# Altium project silnik.PrjPcb
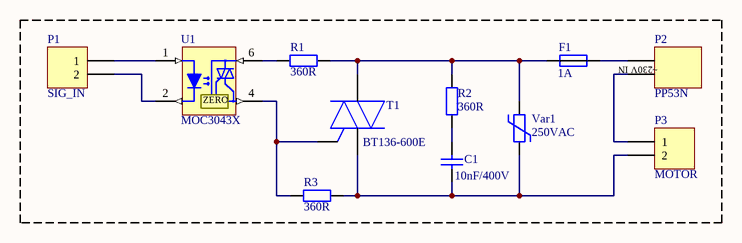
[diagram p0: silnik.SchDoc]
1 sheet, 11 parts. Net scope: global (net labels, ports and power ports of the same name join across sheets).
Board file: silnik.PcbDoc

## Sheet silnik.SchDoc
size A4

### Parts
C1  10nF/400V  [10nF/310VAC]
F1  1A  [5x20mm]
P1  SIG_IN  [PAD2_2.54mm]
P2  PP53N  [PP53N]
P3  MOTOR  [PAD2_5mm]
R1  360R  [RCL_0207/10]
R2  360R  [RCL_0207/10]
R3  360R  [RCL_0207/10]
T1  BT136-600E  [TO-220-H]
U1  MOC3043X  [DIP-6]
Var1  250VAC  [HEL5D391K_5mm_var]

### Nets
NetC1_1: C1.1 R2.1
NetC1_2: C1.2 P3.2 R3.2 T1.1(T1) Var1.2
NetF1_1: F1.1 R1.2 R2.2 T1.2(T2) Var1.1
NetF1_2: F1.2 P2.2
NetP1_1: P1.1 U1.1
NetP1_2: P1.2 U1.2
NetP2_1: P2.1 P3.1
NetR1_1: R1.1 U1.6
NetR3_1: R3.1 T1.3(G) U1.4

### Notes on the sheet
- (in symbol MOC3043X) ZERO
- (in symbol PP53N) ~230V IN

### Library data of the parts
C1 = Cap: Capacitor
F1 = FUSE
P1 P3 = PAD2
P2 = PP53N: Obudowa: do zasilacza; X:78,5mm; Y:40mm; Z:21mm
R1-R3 = Res: Resistor
T1 = BT136-600E: Triak; 600V; 4A; 11mA
Var1 = Varistor: HEL5D391K